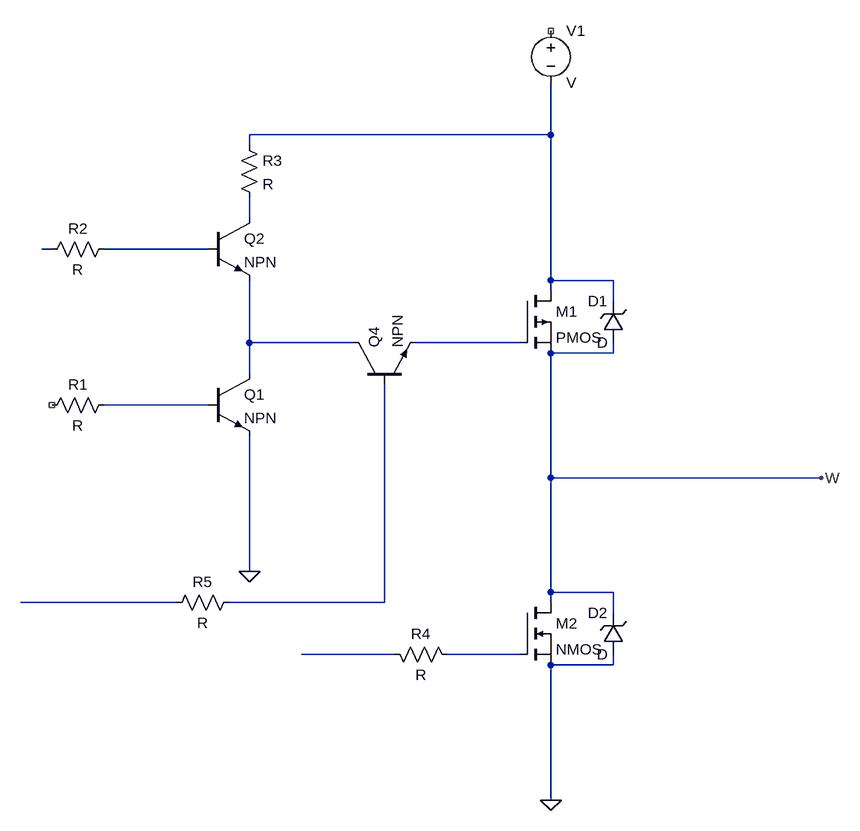
[diagram p0: schematic Sterownik LTSPICE.asc]
Sterownik LTSPICE.asc, the LTspice schematic file:
Version 4
SHEET 1 1020 740
WIRE 560 -304 560 -384
WIRE 560 -304 96 -304
WIRE 96 -288 96 -304
WIRE 96 -176 96 -208
WIRE -208 -128 -224 -128
WIRE 32 -128 -128 -128
WIRE 560 -80 560 -304
WIRE 656 -80 560 -80
WIRE 560 -64 560 -80
WIRE 656 -48 656 -80
WIRE 96 16 96 -80
WIRE 256 16 96 16
WIRE 512 16 352 16
WIRE 656 32 656 16
WIRE 656 32 560 32
WIRE 96 64 96 16
WIRE 32 112 -128 112
WIRE 560 224 560 32
WIRE 976 224 560 224
WIRE 96 368 96 160
WIRE 560 400 560 224
WIRE 656 400 560 400
WIRE -16 416 -256 416
WIRE 304 416 304 80
WIRE 304 416 64 416
WIRE 560 416 560 400
WIRE 656 432 656 400
WIRE 320 496 176 496
WIRE 512 496 400 496
WIRE 656 512 656 496
WIRE 656 512 560 512
WIRE 560 720 560 512
FLAG 96 368 0
FLAG 560 720 0
FLAG 976 224 W
SYMBOL res -112 96 R90
WINDOW 0 0 56 VBottom 2
WINDOW 3 32 56 VTop 2
SYMATTR InstName R1
SYMBOL npn 32 64 R0
SYMATTR InstName Q1
SYMBOL npn 32 -176 R0
SYMATTR InstName Q2
SYMBOL res -112 -144 R90
WINDOW 0 0 56 VBottom 2
WINDOW 3 32 56 VTop 2
SYMATTR InstName R2
SYMBOL voltage 560 -480 R0
SYMATTR InstName V1
SYMBOL pmos 512 -64 R0
SYMATTR InstName M1
SYMBOL zener 672 16 R180
WINDOW 0 24 64 Left 2
WINDOW 3 24 0 Left 2
SYMATTR InstName D1
SYMBOL nmos 512 416 R0
SYMATTR InstName M2
SYMBOL res 80 -304 R0
SYMATTR InstName R3
SYMBOL zener 672 496 R180
WINDOW 0 24 64 Left 2
WINDOW 3 24 0 Left 2
SYMATTR InstName D2
SYMBOL res 304 480 M90
WINDOW 0 0 56 VBottom 2
WINDOW 3 32 56 VTop 2
SYMATTR InstName R4
SYMBOL res 80 400 R90
WINDOW 0 0 56 VBottom 2
WINDOW 3 32 56 VTop 2
SYMATTR InstName R5
SYMBOL npn 256 80 R270
SYMATTR InstName Q4

The netlist it stands for:
* Sterownik LTSPICE.asc
R1 N007 NC_01 R
Q1 N005 N007 0 0 NPN
Q2 N002 N004 N005 0 NPN
R2 N004 N003 R
V1 NC_02 N001 V
M1 N001 N006 W W PMOS
D1 W N001 D
M2 W N011 0 0 NMOS
R3 N001 N002 R
D2 0 W D
R4 N010 N011 R
R5 N009 N008 R
Q4 N005 N009 N006 0 NPN
.model D D
.lib standard.dio
.model NPN NPN
.model PNP PNP
.lib standard.bjt
.model NMOS NMOS
.model PMOS PMOS
.lib standard.mos
.backanno
.end